# Altium schematic sheet Power Supply.SchDoc: Power Supply
size Letter; SheetNumber: 6; SheetTotal: 10
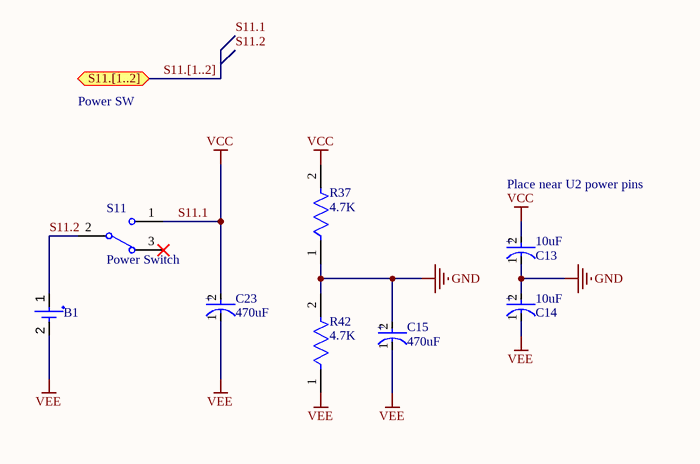
[diagram p0: Power Supply.SchDoc]

## Parts
B1  (no value)  [HDR1X2]
C13  Capacitance: 10uF  [FP-OS-CON-SMT-A5-MFG]  (hidden comment: 865080440002)
C14  Capacitance: 10uF  [FP-OS-CON-SMT-A5-MFG]  (hidden comment: 865080440002)
C15  Capacitance: 470uF  [FP-FTF-MFG]
C23  Capacitance: 470uF  [FP-FTF-MFG]
R37  Resistance: 4.7K  [FP-ESR03-IPC_B]  (hidden comment: ESR03EZPJ472)
R42  Resistance: 4.7K  [FP-ESR03-IPC_B]  (hidden comment: ESR03EZPJ472)
S11  Power Switch  [HDR1X3]

## Ports
S11.[1..2] (bidir)

## Nets
GND: C13.1(C) C14.2(A) C15.2(A) R37.1 R42.2
S11.1: C13.2(A) C23.2(A) R37.2 S11.1  [also labelled VCC]
VEE: B1.2(-) C14.1(C) C15.1(C) C23.1(C) R42.1
S11.2: B1.1(+) S11.2

Not connected (* = marked no-connect by the designer): S11 3*

## Buses and harness runs
bus S11.[1..2] = port S11.[1..2]

## Notes on the sheet
- Power SW
- (near C13) Place near U2 power pins
- Labels drawn without touching a wire or pin: S11.1, S11.2
- (in symbol CMP-05427-000040-1) +
- (in symbol CMP-05427-000158-1) +

## Library data of the parts
B1 = CMP-00622-2: Hldr, Battery, PP3 (6R61), Phospher Bronze, Tin, Panel Mount, 1, Solder Lug; Manufacturer: Bulgin; Manufacturer Part Number: BX0023; Body Material: Nylon,Glass,Bronze; Number of Cells: 1; Supplier 1: Arrow Electronics; Supplier Part Number 1: BX0023; RoHS: Yes; Category: Batteries and Accessories; Stock 1: 80; Pricing 1: 1=11.73100, 10=9.42900, 50=8.50000, 100=7.93600, 250=7.25000, 500=6.86300, 1000=6.28900 (USD); Mount: Panel,Screw; Contact Material: Bronze,Tin; Contact Plating: Tin; Material: Nylon,Glass; Min Operating Temperature: -30°C; Max Operating Temperature: 70°C; Package Quantity: 50; Termination: Solder; Number of Batteries: 1; Packaging: Bulk; Series: BX; REACH SVHC: No SVHC; Flammability Rating: UL94 V-0; RoHS Compliant: Yes; ComponentLink1URL: https://datasheet.ciiva.com/1390/bulgin-2010-p9-1390970.pdf?src-supplier=Element14; ComponentLink1Description: https://datasheet.ciiva.com/1390/bulgin-2010-p9-1390970.pdf?src-supplier=Element14; ComponentLink2URL: https://datasheet.ciiva.com/11714/0900766b80d05969-11714722.pdf?src-supplier=RSComponents; ComponentLink2Description: https://datasheet.ciiva.com/11714/0900766b80d05969-11714722.pdf?src-supplier=RSComponents; ComponentLink3URL: https://datasheet.ciiva.com/3/battholders-2010-3898.pdf?src-supplier=Digi-Key; ComponentLink3Description: https://datasheet.ciiva.com/3/battholders-2010-3898.pdf?src-supplier=Digi-Key; ComponentLink4URL: https://datasheet.ciiva.com/3353/06951396-3353149.pdf?src-supplier=Distrelec; ComponentLink4Description: https://datasheet.ciiva.com/3353/06951396-3353149.pdf?src-supplier=Distrelec; ComponentLink5URL: https://datasheet.ciiva.com/25759/70099004-25759926.pdf?src-supplier=Allied+Electronics; ComponentLink5Description: https://datasheet.ciiva.com/25759/70099004-25759926.pdf?src-supplier=Allied+Electronics; ComponentLink6URL: https://datasheet.ciiva.com/24336/battholders2005-24336774.pdf?src-supplier=Onlinecomponents.com; ComponentLink6Description: https://datasheet.ciiva.com/24336/battholders2005-24336774.pdf?src-supplier=Onlinecomponents.com
C13 C14 = CMP-05427-000158-1: CAP ALUM POLY 10UF 20% 10V SMD; Manufacturer: Wurth Electronics; Voltage Rating: 25V; Polarity: Polar; Ripple Current: 85mA; Impedance: 2.1R; Life (Hours): 2000Hour; Supplier 1: RSComponents; Supplier Part Number 1: 8391799P; Manufacturer Part Number: 865080440002; RoHS: Yes; Category: Aluminum Electrolytic Capacitors; Stock 1: 1; Pricing 1: 25=0.18500, 125=0.12700, 250=0.11600, 500=0.10400 (USD); Mount: Surface Mount; Case/Package: Radial; Min Operating Temperature: -55°C; Max Operating Temperature: 105°C; Package Quantity: 2000; Packaging: Cut Tape; Ripple Current (AC): 85mA; Tolerance: 20%; Voltage Rating (DC): 25V; Diameter: 4mm; Height: 5.5mm; Height - Seated (Max): 0.217inch; REACH SVHC: Unknown; RoHS Compliant: Yes; ComponentLink1URL: http://www.farnell.com/datasheets/1880137.pdf?src-supplier=Farnell; ComponentLink1Description: http://www.farnell.com/datasheets/1880137.pdf?src-supplier=Farnell; ComponentLink2URL: http://www.farnell.com/datasheets/1880137.pdf?src-supplier=Element14; ComponentLink2Description: http://www.farnell.com/datasheets/1880137.pdf?src-supplier=Element14; ComponentLink3URL: https://katalog.we-online.de/pbs/datasheet/865080440002.pdf?src-supplier=Digi-Key; ComponentLink3Description: https://katalog.we-online.de/pbs/datasheet/865080440002.pdf?src-supplier=Digi-Key; ComponentLink4URL: http://katalog.we-online.de/pbs/datasheet/865080440002.pdf?src-supplier=Digi-Key; ComponentLink4Description: http://katalog.we-online.de/pbs/datasheet/865080440002.pdf?src-supplier=Digi-Key
C15 C23 = CMP-05427-000040-1: Manufacturer: Wurth Electronics; Manufacturer Part Number: 865080353015; Voltage Rating: 16V; Polarity: Polar; Ripple Current: 590mA; Impedance: 220mR; Life (Hours): 2000Hour; Tolerance: 20%; Supplier 1: Digi-Key; Supplier Part Number 1: 732-8425-1-ND; RoHS: Yes; Category: Aluminum Electrolytic Capacitors; Stock 1: 263; Pricing 1: 1=0.63000, 50=0.53700, 100=0.46700, 250=0.41600 (USD); Mount: Surface Mount; Case/Package: Radial; Min Operating Temperature: -55°C; Max Operating Temperature: 105°C; Package Quantity: 500; Packaging: Cut Tape; Ripple Current (AC): 590mA; Voltage Rating (DC): 16V; Diameter: 8mm; Height: 10.5mm; Height - Seated (Max): 0.413inch; REACH SVHC: Unknown; RoHS Compliant: Yes; ComponentLink1URL: http://www.farnell.com/datasheets/1880132.pdf?src-supplier=Farnell; ComponentLink1Description: http://www.farnell.com/datasheets/1880132.pdf?src-supplier=Farnell; ComponentLink2URL: http://www.farnell.com/datasheets/1880132.pdf?src-supplier=Element14; ComponentLink2Description: http://www.farnell.com/datasheets/1880132.pdf?src-supplier=Element14; ComponentLink3URL: https://katalog.we-online.de/pbs/datasheet/865080353015.pdf?src-supplier=Digi-Key; ComponentLink3Description: https://katalog.we-online.de/pbs/datasheet/865080353015.pdf?src-supplier=Digi-Key; ComponentLink4URL: http://katalog.we-online.de/pbs/datasheet/865080353015.pdf?src-supplier=Digi-Key; ComponentLink4Description: http://katalog.we-online.de/pbs/datasheet/865080353015.pdf?src-supplier=Digi-Key
R37 R42 = CMP-08839-007853-1: 4.7kΩ ±5% 0.25W 0603 Anti-Surge Chip Resistor AEC-Q200; Max Power Dissipation: 250mW; Temperature Coefficient: 200ppm/°C; Packaging: Tape and Reel; Series: ESR; Height: 0.022inch; Case Code (Imperial): 0603; Tolerance: 5%; RoHS Compliant: Yes; Case/Package: 0603; Min Operating Temperature: -55°C; Resistor Type: Thick Film; Package Quantity: 5000; Features: Automotive AEC-Q200; Width: 0.031inch; Length: 0.063inch; Max Operating Temperature: 155°C; Number of Terminations: 2
S11 = SW-SPDT: Switch Toggle ON None ON SPDT Round Lever Solder Lug 5A 250VAC 28VDC Panel Mount with Threads; Manufacturer: E-Switch; Manufacturer Part Number: 100SP1T1B1M1QEH; Actuator Material: Brass,Chrome; Actuator Color: Chrome; Voltage Rating (AC): 120V; Voltage Rating (DC): 28V; Max Voltage Rating (AC): 250V; Illumination Type: Illuminated,Non-Illuminated; Switch Function: On-On; Actuator Type: Standard Round; Contact Resistance: 100mR; Electrical Life: 40000Cycles; Actuator Length: 10.41mm; Supplier 1: Newark; Supplier Part Number 1: 15N9971; RoHS: Yes; Category: Toggle Switches; Stock 1: 978; Pricing 1: 1=3.08000, 10=2.76000, 25=2.61000, 50=2.49000, 100=2.37000 (USD); Mount: Panel; Contact Material: Copper Alloy,Silver; Contact Plating: Silver; Housing Material: Stainless Steel; Min Operating Temperature: -30°C; Max Operating Temperature: 85°C; Throw Configuration: SPDT; Current Rating: 5A; Package Quantity: 1; Packaging: Bulk; Max Voltage Rating (DC): 28V; Termination: Solder; Orientation: Straight; Series: 100; REACH SVHC: No SVHC; Lead Free: Lead Free; RoHS Compliant: Yes; ComponentLink1URL: https://datasheet.ciiva.com/2904/st110007c-2904798.pdf?src-supplier=Digi-Key; ComponentLink1Description: https://datasheet.ciiva.com/2904/st110007c-2904798.pdf?src-supplier=Digi-Key; ComponentLink2URL: https://datasheet.ciiva.com/16154/xt0157p-16154561.pdf?src-supplier=Onlinecomponents.com; ComponentLink2Description: https://datasheet.ciiva.com/16154/xt0157p-16154561.pdf?src-supplier=Onlinecomponents.com; ComponentLink3URL: https://datasheet.ciiva.com/16347/100-16347391.pdf?src-supplier=Future+Electronics; ComponentLink3Description: https://datasheet.ciiva.com/16347/100-16347391.pdf?src-supplier=Future+Electronics